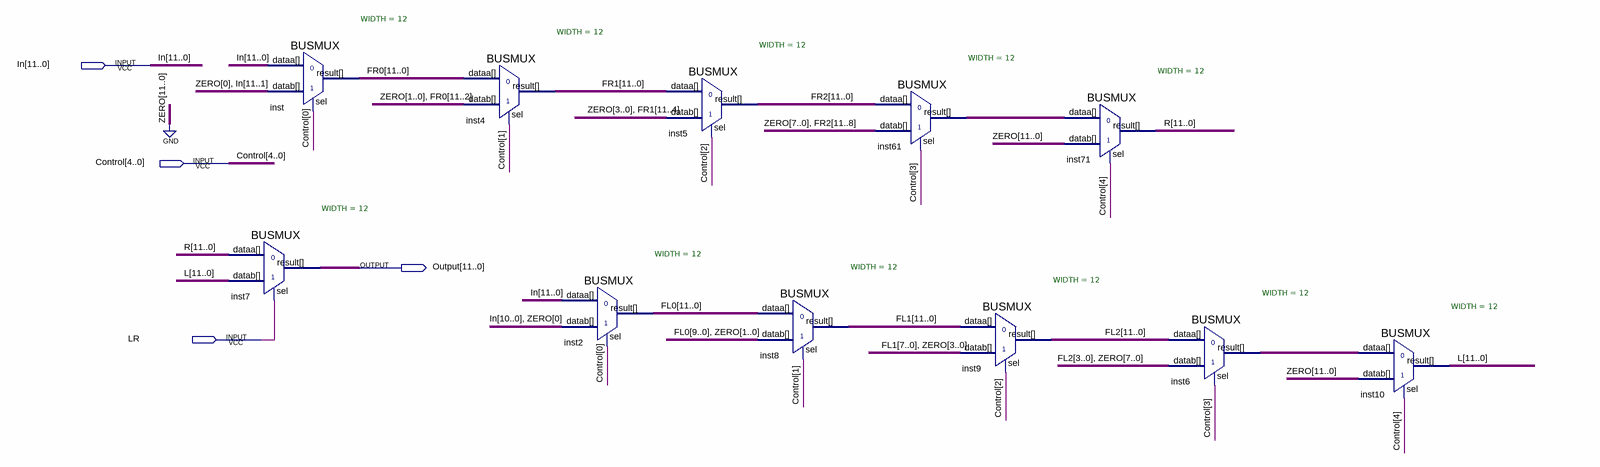
[diagram p0: schematic sheet]
// Quartus schematic Shift_Right.bdf as structural Verilog: 11 symbols, 4 pins
module Shift_Right (
  input  [11:0] In,
  input  [4:0] Control,
  input  LR,
  output [11:0] Output
);

  wire [11:0] FL0, FL1, FL2, FR0, FR1, FR2, inst6_result, inst61_result, L, R;

  BUSMUX #(.WIDTH(12)) inst (.datab({1'b0, In[11:1]}), .sel(Control[0]), .dataa(In), .result(FR0));
  BUSMUX #(.WIDTH(12)) inst7 (.datab(L), .sel(LR), .dataa(R), .result(Output));
  BUSMUX #(.WIDTH(12)) inst4 (.datab({2'b00, FR0[11:2]}), .sel(Control[1]), .dataa(FR0), .result(FR1));
  BUSMUX #(.WIDTH(12)) inst2 (.datab({In[10:0], 1'b0}), .sel(Control[0]), .dataa(In), .result(FL0));
  BUSMUX #(.WIDTH(12)) inst5 (.datab({4'b0000, FR1[11:4]}), .sel(Control[2]), .dataa(FR1), .result(FR2));
  BUSMUX #(.WIDTH(12)) inst8 (.datab({FL0[9:0], 2'b00}), .sel(Control[1]), .dataa(FL0), .result(FL1));
  BUSMUX #(.WIDTH(12)) inst61 (.datab({{8{1'b0}}, FR2[11:8]}), .sel(Control[3]), .dataa(FR2), .result(inst61_result));
  BUSMUX #(.WIDTH(12)) inst9 (.datab({FL1[7:0], 4'b0000}), .sel(Control[2]), .dataa(FL1), .result(FL2));
  BUSMUX #(.WIDTH(12)) inst71 (.datab({12{1'b0}}), .sel(Control[4]), .dataa(inst61_result), .result(R));
  BUSMUX #(.WIDTH(12)) inst6 (.datab({FL2[3:0], {8{1'b0}}}), .sel(Control[3]), .dataa(FL2), .result(inst6_result));
  BUSMUX #(.WIDTH(12)) inst10 (.datab({12{1'b0}}), .sel(Control[4]), .dataa(inst6_result), .result(L));
endmodule
